# Altium project button.PrjPCB
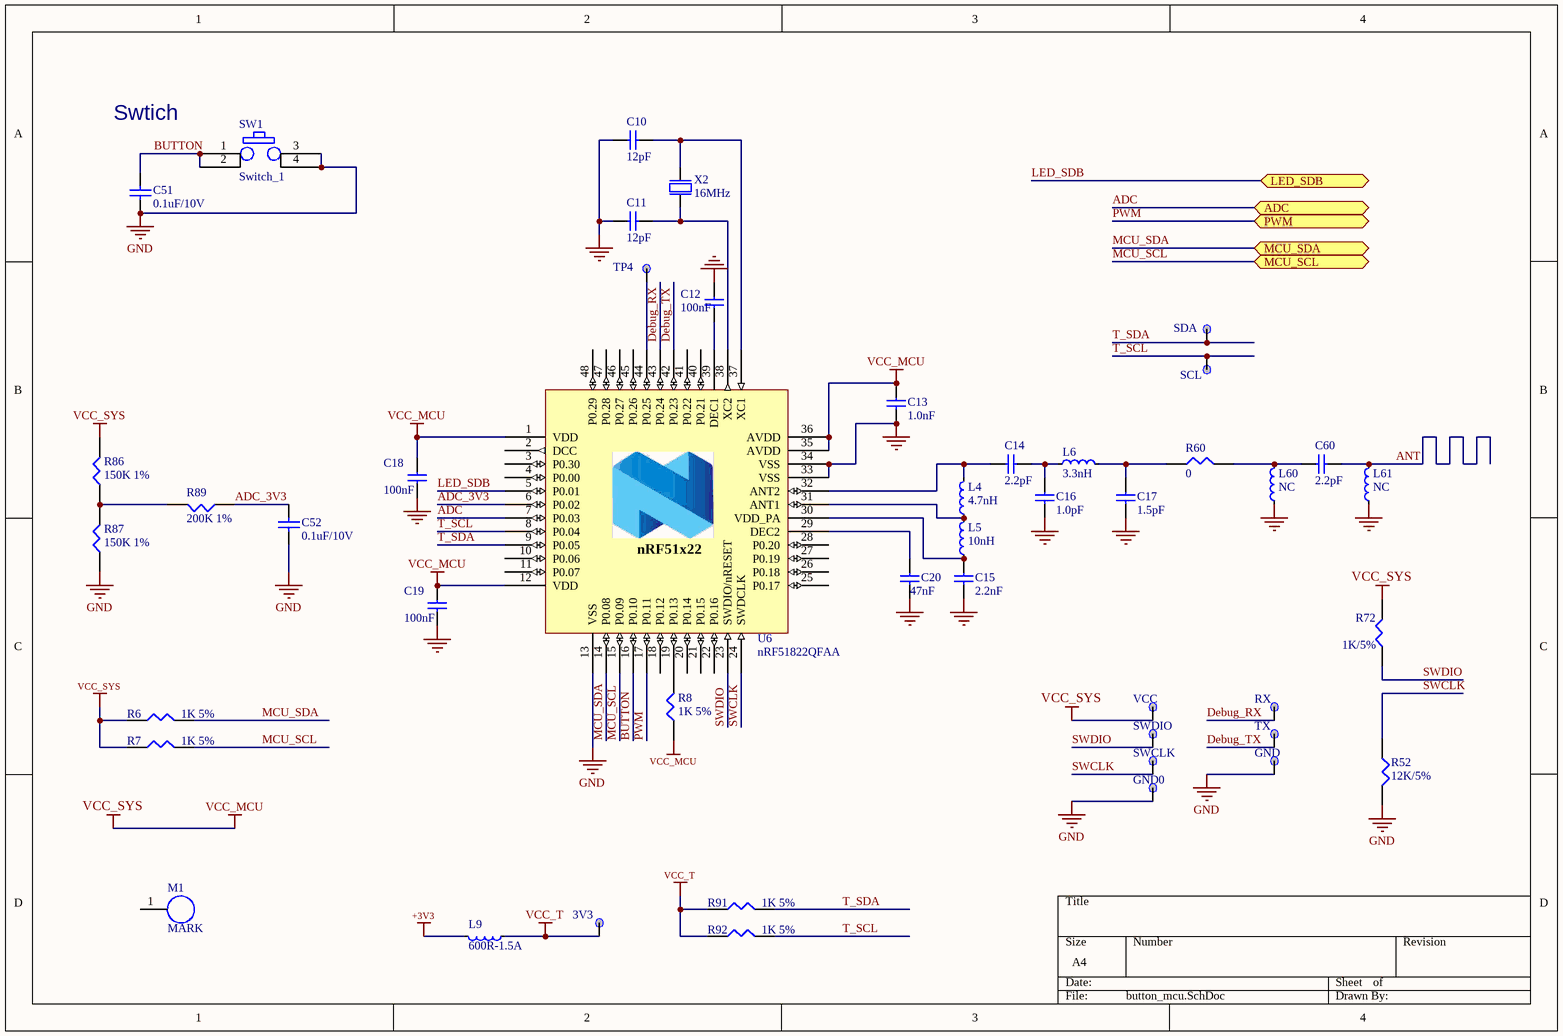
[diagram p0: button_mcu.SchDoc]
3 sheets, 85 parts. Net scope: flat (ports and power ports of the same name join across sheets).
Board file: button_PVT.PcbDoc
Sheets:
  button_mcu.SchDoc
  button_peripheral.SchDoc
  LED.SchDoc

## Sheet button_mcu.SchDoc
size A4

### Parts
3V3  TP  [TESTPOINT_PAD]  (value not drawn)
C10  12pF  [CAPC1005X04L]
C11  12pF  [CAPC1005X04L]
C12  100nF  [CAPC1005X04L]
C13  1.0nF  [CAPC1005X04L]
C14  2.2pF  [CAPC1005X04L]
C15  2.2nF  [CAPC1005X04L]
C16  1.0pF  [CAPC1005X04L]
C17  1.5pF  [CAPC1005X04L]
C18  100nF  [CAPC1005X04L]
C19  100nF  [CAPC1005X04L]
C20  47nF  [CAPC1005X04L]
C51  0.1uF/10V  [0402C]
C52  0.1uF/10V  [0402C]
C60  2.2pF  [0402C]
GND  TP  [TESTPOINT2]  (value not drawn)
GND0  TP  [TESTPOINT2]  (value not drawn)
L4  4.7nH  [INDC1005X04L]
L5  10nH  [INDC1005X04L]
L6  3.3nH  [INDC1005X04L]
L9  600R-1.5A  [L_0603]
L60  NC  [0402R]
L61  NC  [0402R]
M1  MARK  [Mark Point]
R6  1K 5%  [0402R]
R7  1K 5%  [0402R]
R8  1K 5%  [0402R]
R52  12K/5%  [0402R]
R60  0  [0402R]
R72  1K/5%  [0402R]
R86  150K 1%  [0402R]
R87  150K 1%  [0402R]
R89  200K 1%  [0402R]
R91  1K 5%  [0402R]
R92  1K 5%  [0402R]
RX  TP  [TESTPOINT2]  (value not drawn)
SCL  TP  [TESTPOINT_PAD]  (value not drawn)
SDA  TP  [TESTPOINT_PAD]  (value not drawn)
SW1  Switch_1  [KEY_Panasonic]
SWCLK  TP  [TESTPOINT2]  (value not drawn)
SWDIO  TP  [TESTPOINT2]  (value not drawn)
TP4  TP  [TESTPOINT2]  (value not drawn)
TX  TP  [TESTPOINT2]  (value not drawn)
U6  nRF51822QFAA  [QFN40P600X600X90-48N]
VCC  TP  [TESTPOINT2]  (value not drawn)
X2  16MHz  [XTAL/3225]

### Ports
ADC, LED_SDB, MCU_SCL, MCU_SDA, PWM

### Nets
+3V3: L9.2
GND: C10.2 C11.2 C12.1 C13.2 C15.2 C16.2 C17.2 C18.2 C19.2 C20.2 C51.1 C52.1 GND.1 GND0.1 L60.1 L61.1 R52.2 R87.1 SW1.3 SW1.4 U6.13(VSS) U6.33(VSS) U6.34(VSS) U6.49 X2.2(GND) X2.4(GND)
VCC_MCU: C13.1 C18.1 C19.1 R6.1 R7.1 R8.1 R72.2 R86.2 U6.1(VDD) U6.12(VDD) U6.35(AVDD) U6.36(AVDD) VCC.1  [also labelled VCC_SYS]
VCC_T: 3V3.1 L9.1 R91.1 R92.1
ADC: U6.7(P0.03) ; port ADC
ADC_3V3: C52.2 R89.1 U6.6(P0.02)
ANT: C60.2 L61.2
BUTTON: C51.2 SW1.1 SW1.2 U6.16(P0.10)
Debug_RX: RX.1 U6.43(P0.24)
Debug_TX: TX.1 U6.42(P0.23)
LED_SDB: U6.5(P0.01) ; port LED_SDB
MCU_SCL: R7.2 U6.15(P0.09) ; port MCU_SCL  [project net G_SCL]
MCU_SDA: R6.2 U6.14(P0.08) ; port MCU_SDA  [project net G_SDA]
PWM: U6.17(P0.11) ; port PWM
SWCLK: R52.1 SWCLK.1 U6.24(SWDCLK)
SWDIO: R72.1 SWDIO.1 U6.23(SWDIO/nRESET)
T_SCL: R92.2 SCL.1 U6.8(P0.04)
T_SDA: R91.2 SDA.1 U6.9(P0.05)
NetC10_1: C10.1 U6.37(XC1) X2.1(inp)
NetC11_1: C11.1 U6.38(XC2) X2.3(out)
NetC12_2: C12.2 U6.39(DEC1)
NetC14_1: C14.1 L4.2 U6.32(ANT2)
NetC14_2: C14.2 C16.1 L6.1
NetC15_1: C15.1 L5.1 U6.30(VDD_PA)
NetC17_1: C17.1 L6.2 R60.1
NetC20_1: C20.1 U6.29(DEC2)
NetC60_1: C60.1 L60.2 R60.2
NetL4_1: L4.1 L5.2 U6.31(ANT1)
NetR8_2: R8.2 U6.19(P0.13)
NetR86_1: R86.1 R87.2 R89.2
NetTP4_1: TP4.1 U6.44(P0.25)

Not connected (* = marked no-connect by the designer): M1 1; U6 2(DCC) 3(P0.30) 4(P0.00) 10(P0.06) 11(P0.07) 18(P0.12) 20(P0.14) 21(P0.15) 22(P0.16) 25(P0.17) 26(P0.18) 27(P0.19) 28(P0.20) 40(P0.21) 41(P0.22) 45(P0.26) 46(P0.27) 47(P0.28) 48(P0.29)

### Notes on the sheet
- Swtich
- (in symbol nRF51x22-QFAC) nRF51x22

### Library data of the parts
3V3 GND GND0 RX SCL SDA SWCLK SWDIO TP4 TX VCC = TP: Ordered by: Subcon
C10 C11 = C0402-12p: Capacitor, NP0, ±2%; Note: 50V; Artikkelnr Noca: 20029159; Artikkelnr Simpro: N.A.; Part Number: C0402-12p; Manufacturer: *; Manufacturer Part Number: *; Datasheet: *; LatestRevisionDate: 2011-05-11; Pin Count: 2; Publisher: Nordic Semiconductor; Published: 2009-05-08; Value: 12pF; Supplier: *; Supplier part number: *; 2nd source Supplier: *; 2nd source part number: *; Footprint Doc: 0402
C12 C18 C19 = C0402-100n: Capacitor, X7R, ±10%; Note: 16V; Artikkelnr Noca: 20039200; Artikkelnr Simpro: N.A.; Part Number: C0402-100n; Manufacturer: *; Manufacturer Part Number: *; Datasheet: *; LatestRevisionDate: 2009-11-23; Pin Count: 2; Publisher: Nordic Semiconductor; Published: 2009-05-08; Value: 100nF; Supplier: *; Supplier part number: *; 2nd source Supplier: *; 2nd source part number: *; Footprint Doc: 0402
C13 = C0402-1n0: Capacitor, X7R, ±10%; Note: 50V; Artikkelnr Noca: 20039223; Artikkelnr Simpro: N.A.; Part Number: C0402-1n0; Manufacturer: *; Manufacturer Part Number: *; Datasheet: *; LatestRevisionDate: 2009-11-23; Pin Count: 2; Publisher: Nordic Semiconductor; Published: 2009-05-08; Value: 1.0nF; Supplier: *; Supplier part number: *; 2nd source Supplier: *; 2nd source part number: *; Footprint Doc: 0402
C14 C60 = C0402-3.9p: Capacitor, NP0, ±0.1pF; Value: 3.9pF; Note: 50V; Artikkelnr Noca: N.A.; Part Number: C0402-3.9p; Manufacturer: *; Manufacturer Part Number: *; Datasheet: *; LatestRevisionDate: 2014-09-17; Pin Count: 2; Publisher: Nordic Semiconductor; Published: 2009-05-08; Supplier: *; Supplier part number: *; 2nd source Supplier: *; 2nd source part number: *; Footprint Doc: 0402; Artikkelnr Simpro: N.A.
C15 = C0402-2n2: Capacitor, X7R, ±10%; Note: 50V; Artikkelnr Noca: 20039221; Artikkelnr Simpro: N.A.; Part Number: C0402-2n2; Manufacturer: *; Manufacturer Part Number: *; Datasheet: *; LatestRevisionDate: 2009-11-23; Pin Count: 2; Publisher: Nordic Semiconductor; Published: 2009-05-08; Value: 2.2nF; Supplier: *; Supplier part number: *; 2nd source Supplier: *; 2nd source part number: *; Footprint Doc: 0402
C16 = C0402-1.0p: Capacitor, NP0, ±0.1pF; Note: 50V; Artikkelnr Noca: 20029140; Artikkelnr Simpro: N.A.; Part Number: C0402-1.0p; Manufacturer: *; Manufacturer Part Number: *; Datasheet: *; LatestRevisionDate: 2009-11-23; Pin Count: 2; Publisher: Nordic Semiconductor; Published: 2009-05-08; Value: 1.0pF; Supplier: *; Supplier part number: *; 2nd source Supplier: *; 2nd source part number: *; Footprint Doc: 0402
C17 = C0402-1.5p: Capacitor, NP0, ±0.1pF; Note: 50V; Artikkelnr Noca: 20029139; Artikkelnr Simpro: N.A.; Part Number: C0402-1.5p; Manufacturer: *; Manufacturer Part Number: *; Datasheet: *; LatestRevisionDate: 2009-11-23; Pin Count: 2; Publisher: Nordic Semiconductor; Published: 2009-05-08; Value: 1.5pF; Supplier: *; Supplier part number: *; 2nd source Supplier: *; 2nd source part number: *; Footprint Doc: 0402
C20 = C0402-47n: Capacitor, X7R, ±10%; Note: Chip Cap 10%; Artikkelnr Noca: 20039389; Artikkelnr Simpro: N.A.; Part Number: C0402-47n; Manufacturer: *; Manufacturer Part Number: *; Datasheet: *; LatestRevisionDate: 2009-05-08; Pin Count: 2; Publisher: Nordic Semiconductor; Published: 2009-05-08; Value: 47nF; Supplier: *; Supplier part number: *; 2nd source Supplier: *; 2nd source part number: *; Footprint Doc: 0402
C51 C52 = CAP: Capacitor; Value: 100pF; Ordered by: Subcon; Published: 8-Jun-2000; Revision: July-2002: Re-released for DXP Platform.; Publisher: Altium Limited
L4 = L0402-4n7: High frequency chip inductor ±5%; Manufacturer: Murata; Manufacturer Part Number: LQP15MN4N7B02D; Artikkelnr Noca: 33029164; Artikkelnr Simpro: N.A.; Part Number: L0402-4n7; Datasheet: http://search.murata.co.jp/Ceramy/image/img/PDF/ENG/L0075S0084LQP15M.pdf; LatestRevisionDate: 2012-09-19; Pin Count: 2; Publisher: Nordic Semiconductor; Published: 2009-05-08; Value: 4.7nH; Note: High frequency chip inductor ±5%; Supplier: Digi-Key; Supplier part number: 490-1132-1-ND; 2nd source Supplier: *; 2nd source part number: *; Footprint Doc: 0402
L5 L9 = L0402-27n: High frequency chip inductor ±5%; Manufacturer: Murata; Manufacturer Part Number: LQP15MN27NG02D; Value: 27nH; Note: High frequency chip inductor ±2%; Artikkelnr Noca: N.A.; Part Number: L0402-27n; Datasheet: http://search.murata.co.jp/Ceramy/image/img/PDF/ENG/L0075S0084LQP15M.pdf; LatestRevisionDate: 2014-09-17; Pin Count: 2; Publisher: Nordic Semiconductor; Published: 2014-06-12; Supplier: Digi-Key; Supplier part number: 490-6751-1-ND; 2nd source Supplier: *; 2nd source part number: *; Footprint Doc: 0402; Artikkelnr Simpro: N.A.
L6 = L0402-3n3: High frequency chip inductor ±5%; Manufacturer: Murata; Manufacturer Part Number: LQP15MN3N3B02D; Artikkelnr Noca: 33029369; Artikkelnr Simpro: N.A.; Part Number: L0402-3n3; Datasheet: http://search.murata.co.jp/Ceramy/image/img/PDF/ENG/L0075S0084LQP15M.pdf; LatestRevisionDate: 2012-09-19; Pin Count: 2; Publisher: Nordic Semiconductor; Published: 2009-05-08; Value: 3.3nH; Note: High frequency chip inductor ±5%; Supplier: Digi-Key; Supplier part number: 490-1130-1-ND; 2nd source Supplier: *; 2nd source part number: *; Footprint Doc: 0402
L60 L61 = L0402-4n7: High frequency chip inductor ±5%; Manufacturer: Murata; Manufacturer Part Number: LQP15MN4N7B02D; Value: 4.7nH; Artikkelnr Noca: 33029164; Artikkelnr Simpro: N.A.; Part Number: L0402-4n7; Datasheet: http://search.murata.co.jp/Ceramy/image/img/PDF/ENG/L0075S0084LQP15M.pdf; LatestRevisionDate: 2012-09-19; Pin Count: 2; Publisher: Nordic Semiconductor; Published: 2009-05-08; Note: High frequency chip inductor ±5%; Supplier: Digi-Key; Supplier part number: 490-1132-1-ND; 2nd source Supplier: *; 2nd source part number: *; Footprint Doc: 0402
M1 = PAD1: None
R6-R8 R52 R60 R72 R86 R87 R89 R91 R92 = RES1: 厂家：Yageo，型号：RC0402FR-0720RL
SW1 = Switch_1: 厂家：松下，型号：EVQPLMA15
U6 = nRF51x22-QFAC: Multi-protocol Bluetooth Low Energy, ANT and 2.4GHz proprietary system-on-chip; Manufacturer: Nordic Semiconductor; Note: nRF51422 - QFN48 6x6 0.4mm pitch; Artikkelnr Noca: N.A.; Part Number: nRF51x22-QFAC; Manufacturer Part Number: nRF51x22-QFAC; Datasheet: *; LatestRevisionDate: 2014-09-24; Pin Count: 48; Publisher: Nordic Semiconductor; Published: 2014-09-24; Value: nRF51x22-QFAC; Supplier: Nordic Semiconductor; Supplier part number: *; 2nd source Supplier: *; 2nd source part number: *; Footprint Doc: QFN-48; Artikkelnr Simpro: N.A.
X2 = NX2520SA-16MHZ-STD-CSW-5: XTAL SMD 2520, 16MHz, 8pF, ±40ppm; Manufacturer: NDK; Note: XTAL SMD 16.000MHz; Artikkelnr Noca: 22019192; Artikkelnr Simpro: N.A.; Part Number: NX2520SA-16MHZ-STD-CSW-5; Manufacturer Part Number: NX2520SA-16MHZ-STD-CSW-5; Datasheet: http://www.ndk.com/images/products/catalog/c_NX2520SA-STD-CSW-5_e.pdf; LatestRevisionDate: 2012-06-15; Pin Count: 4; Publisher: Nordic Semiconductor; Published: 2012-06-15; Value: 16MHz; Supplier: Digi-Key; Supplier part number: 644-1169-1-ND; 2nd source Supplier: *; 2nd source part number: *; Footprint Doc: BT-XTAL_2520

## Sheet button_peripheral.SchDoc
size A4
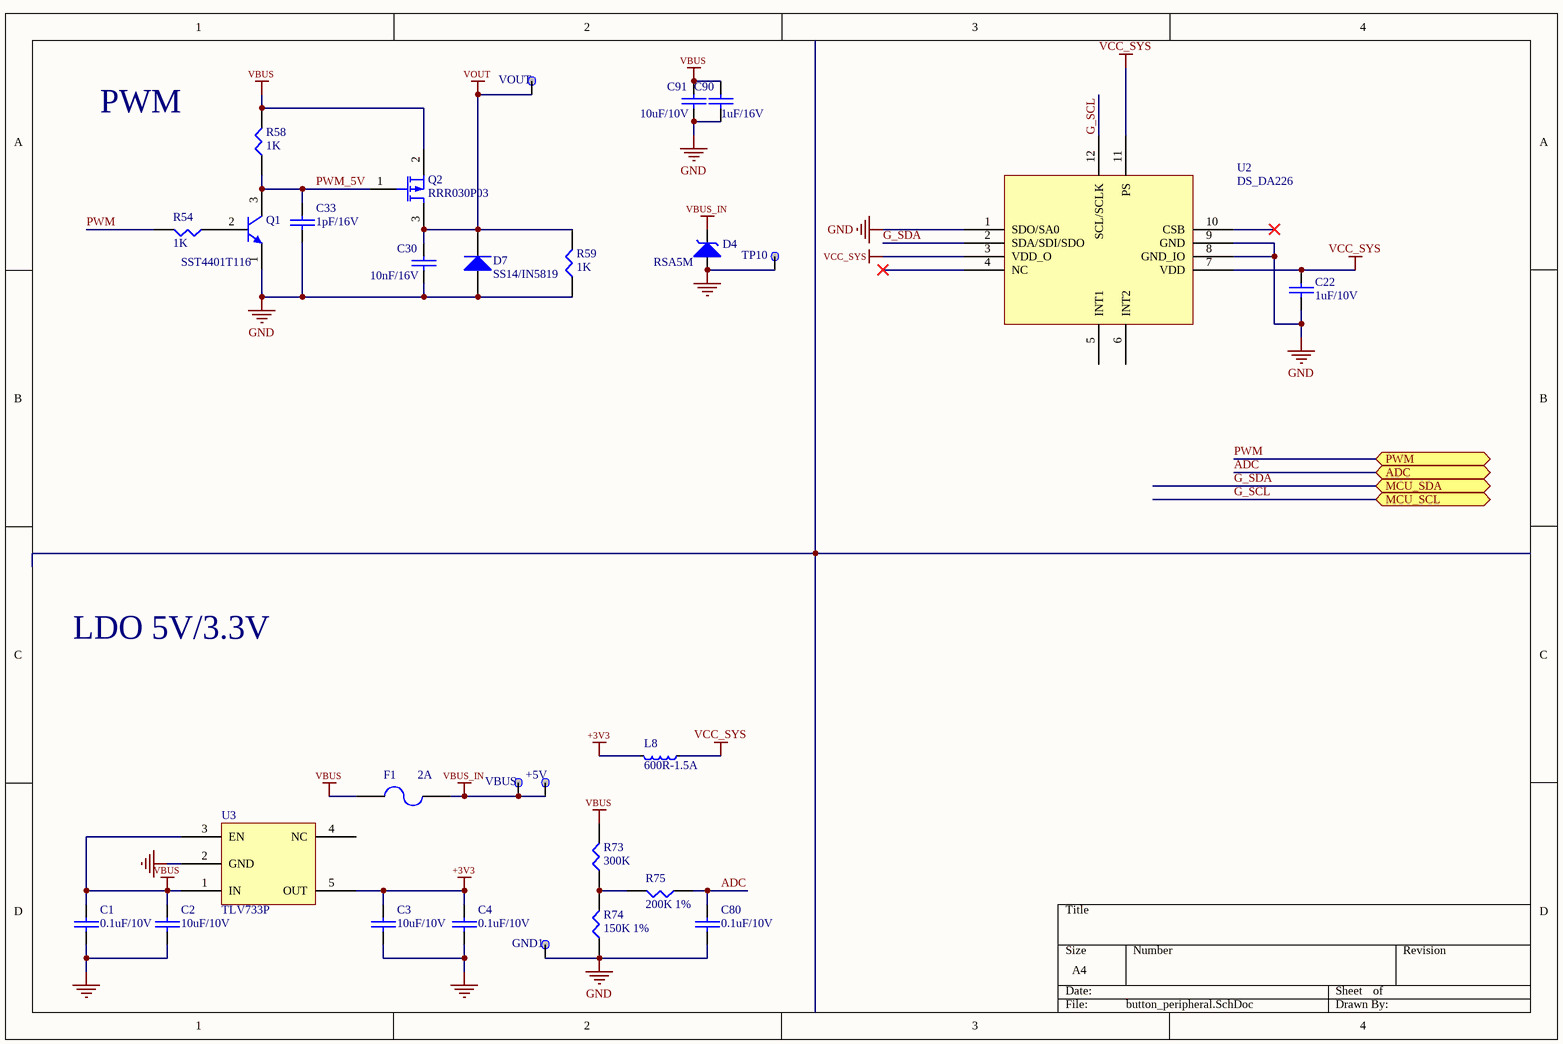
[diagram p1: button_peripheral.SchDoc]

### Parts
+5V  TP  [TESTPOINT2]  (value not drawn)
C1  0.1uF/10V  [0402C]
C2  10uF/10V  [0603C]
C3  10uF/10V  [0603C]
C4  0.1uF/10V  [0402C]
C22  1uF/10V  [0402C]
C30  10nF/16V  [0402C]
C33  1pF/16V  [0402C]
C80  0.1uF/10V  [0402C]
C90  1uF/16V  [0603C]
C91  10uF/10V  [LC-CASE-P_2012]
D4  RSA5M  [SOD-123]
D7  SS14/IN5819  [PROGRAM_1/2]
F1  2A  [0805]
GND1  TP  [TESTPOINT_PAD]  (value not drawn)
L8  600R-1.5A  [L_0603]
Q1  SST4401T116  [LC-SOT-23(SOT-23-3)]
Q2  RRR030P03  [TSMT3]
R54  1K  [0402R]
R58  1K  [0402R]
R59  1K  [0402R]
R73  300K  [0402R]
R74  150K 1%  [0402R]
R75  200K 1%  [0402R]
TP10  TP  [TESTPOINT_PAD]  (value not drawn)
U2  DS_DA226  [LGA-12]
U3  TLV733P  [SOT-23-5]
VBUS  TP  [TESTPOINT_PAD]  (value not drawn)
VOUT  TP  [TESTPOINT_PAD]  (value not drawn)

### Ports
ADC, MCU_SCL, MCU_SDA, PWM

### Nets
+3V3: C3.1 C4.1 L8.2 U3.5(OUT)
GND: C1.2 C2.2 C3.2 C4.2 C22.2 C30.2 C33.2 C80.2 C90.2 C91.2 D4.2(dIode2) D7.2(A) GND1.1 Q1.1(E) R59.1 R74.1 TP10.1 U2.1(SDO/SA0) U2.8(GND_IO) U2.9(GND) U3.2(GND)
VBUS: C1.1 C2.1 C90.1 C91.1 F1.1 Q2.2(S) R58.2 R73.2 U3.1(IN) U3.3(EN)
VBUS_IN: +5V.1 D4.1(Diode1) F1.2 VBUS.1
VCC_SYS: C22.1 L8.1 U2.3(VDD_O) U2.7(VDD) U2.11(PS)  [project net VCC_MCU]
VOUT: C30.1 D7.1(K) Q2.3(D) R59.2 VOUT.1
ADC: C80.1 R75.1 ; port ADC
G_SCL: U2.12(SCL/SCLK) ; port MCU_SCL
G_SDA: U2.2(SDA/SDI/SDO) ; port MCU_SDA
PWM: R54.2 ; port PWM
PWM_5V: C33.1 Q1.3(C) Q2.1(G) R58.1
NetQ1_2: Q1.2(B) R54.1
NetR73_1: R73.1 R74.2 R75.2

Not connected (* = marked no-connect by the designer): U2 4(NC)* 5(INT1) 6(INT2) 10(CSB)*; U3 4(NC)

### Notes on the sheet
- PWM
- LDO 5V/3.3V

### Library data of the parts
+5V GND1 TP10 VBUS VOUT = TP: Ordered by: Subcon
C1 C4 C22 C30 C33 C80 = CAP: 厂家：Murata，型号：GRM155R71A104KA01D
C2 C3 C90 C91 = CAP: 厂家：Murata，型号：GRM188R61A106KE69D
D4 = ESD_1: 厂家：ROHM，型号：VMNZC6.8CST2RA
D7 = Diode 1N4148: High Conductance Fast Diode
F1 = FUSE2: 厂家：万瑞和，型号：smd1206-200
L8 = L0402-27n: as L5 on sheet button_mcu; Part Number: L0402-27n; Datasheet: http://search.murata.co.jp/Ceramy/image/img/PDF/ENG/L0075S0084LQP15M.pdf; LatestRevisionDate: 2014-09-17; Pin Count: 2; Publisher: Nordic Semiconductor; Published: 2014-06-12; Supplier: Digi-Key; Supplier part number: 490-6751-1-ND; 2nd source Supplier: *; 2nd source part number: *; Footprint Doc: 0402; Artikkelnr Simpro: N.A.
Q1 = 2N3904: NPN General Purpose Amplifier; Published: 8-Jun-2000; LatestRevisionDate: 15-Jan-2003; LatestRevisionNote: PCB Footprint 'BCY-W3/D4.7' replaced; DatasheetVersion: 1997; PackageVersion: Sep-1998; PackageReference: TO-92A; Publisher: Altium Limited; PackageDescription: TO, Flat Index; 3 In-Line, Axial Leads; Body Dia. 4.5mm; Leads 0.51 x 0.48 mm (max); ComponentLink1Description: Manufacturer Link; ComponentLink1URL: http://www.fairchildsemi.com/; ComponentLink2Description: Datasheet; ComponentLink2URL: http://www.fairchildsemi.com/ds/2N%2F2N3904.pdf
Q2 = MOSFET-P: P-Channel MOSFET; Published: 8-Jun-2000; LatestRevisionDate: 17-Jul-2002; LatestRevisionNote: Re-released for DXP Platform.; PackageVersion: 1995/1996; PackageReference: E3; Publisher: Altium Limited; PackageDescription: TO, Flat Index; 3 In-Line, Axial Leads; Body Dia. 4.6mm; Lead Dia. 0.5 mm (max)
R54 R58 R59 R73-R75 = RES1: 厂家：Yageo，型号：RC0402FR-0720RL
U2 = LI: 厂家：ST，型号：LIS2DH12
U3 = AP3410

## Sheet LED.SchDoc
size A4
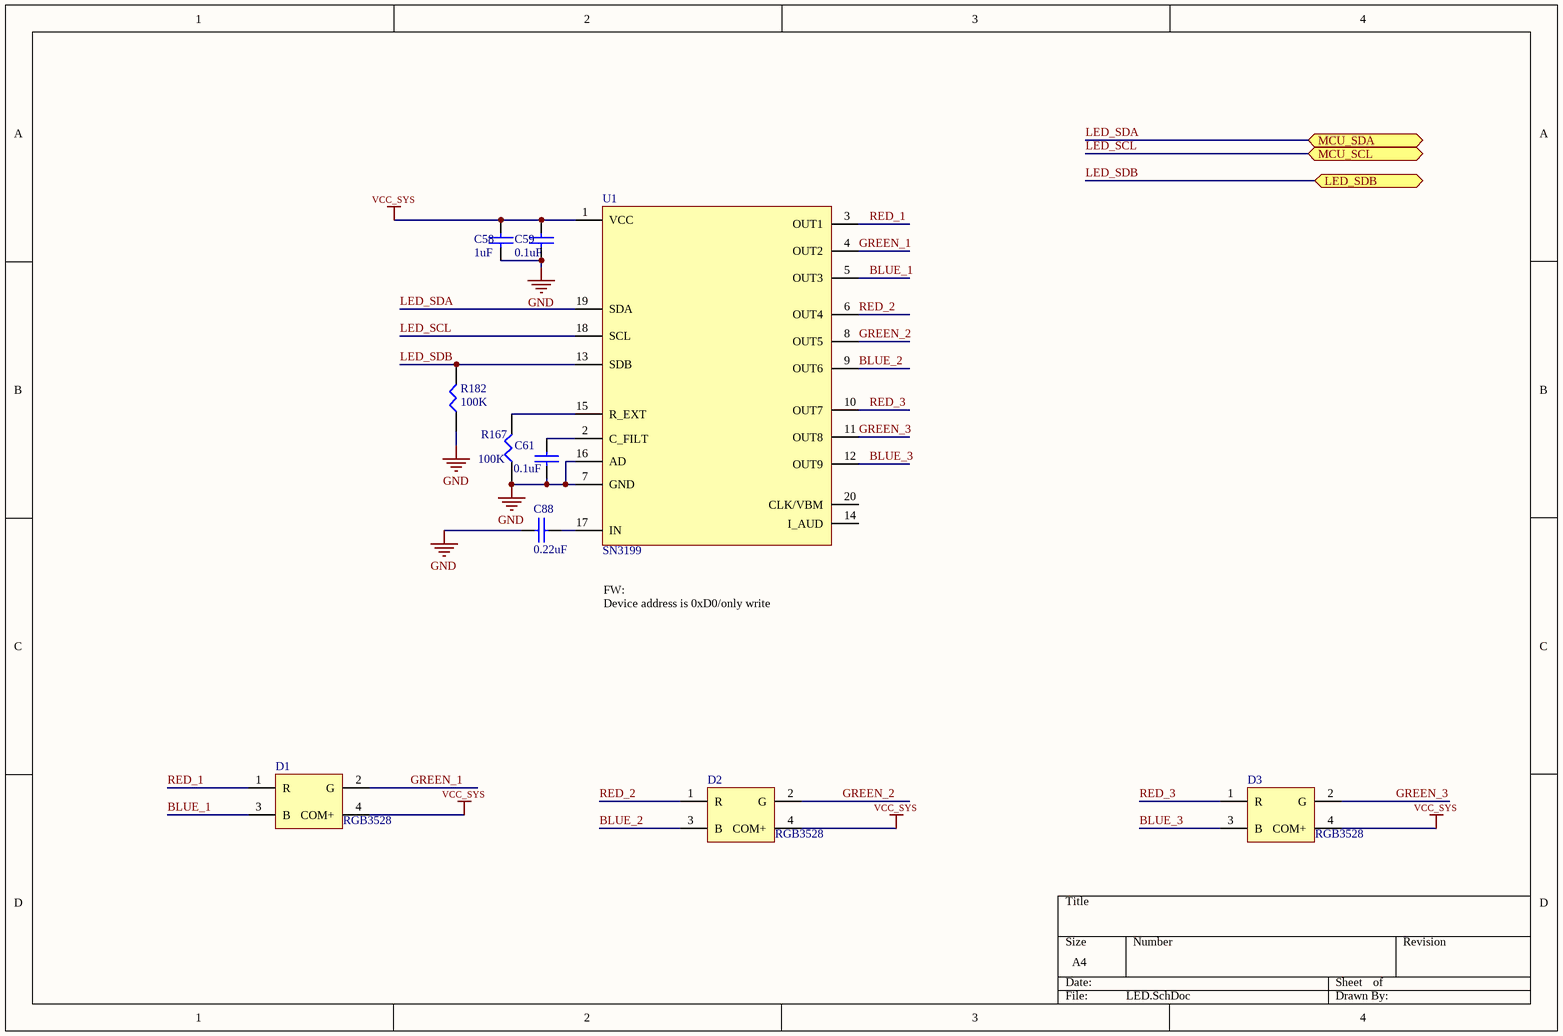
[diagram p2: LED.SchDoc]

### Parts
C58  1uF  [0402C]
C59  0.1uF  [0402C]
C61  0.1uF  [0402C]
C88  0.22uF  [0402C]
D1  RGB3528  [R6GHBHC]
D2  RGB3528  [R6GHBHC]
D3  RGB3528  [R6GHBHC]
R167  100K  [0402R]
R182  100K  [0402R]
U1  SN3199  [QFN20-B]

### Ports
LED_SDB, MCU_SCL, MCU_SDA

### Nets
GND: C58.2 C59.2 C61.2 C88.1 R167.1 R182.1 U1.7(GND) U1.16(AD)
VCC_SYS: C58.1 C59.1 D1.4(COM+) D2.4(COM+) D3.4(COM+) U1.1(VCC)  [project net VCC_MCU]
BLUE_1: D1.3(B) U1.5(OUT3)
BLUE_2: D2.3(B) U1.9(OUT6)
BLUE_3: D3.3(B) U1.12(OUT9)
GREEN_1: D1.2(G) U1.4(OUT2)
GREEN_2: D2.2(G) U1.8(OUT5)
GREEN_3: D3.2(G) U1.11(OUT8)
LED_SCL: U1.18(SCL) ; port MCU_SCL  [project net G_SCL]
LED_SDA: U1.19(SDA) ; port MCU_SDA  [project net G_SDA]
LED_SDB: R182.2 U1.13(SDB) ; port LED_SDB
RED_1: D1.1(R) U1.3(OUT1)
RED_2: D2.1(R) U1.6(OUT4)
RED_3: D3.1(R) U1.10(OUT7)
NetC61_1: C61.1 U1.2(C_FILT)
NetC88_2: C88.2 U1.17(IN)
NetR167_2: R167.2 U1.15(R_EXT)

Not connected (* = marked no-connect by the designer): U1 14(I_AUD) 20(CLK/VBM)

### Notes on the sheet
- FW:
  Device address is 0xD0/only write

### Library data of the parts
C58 = CAP: 1uF/10V/X7R/10%，0402
C59 C61 = CAP: 0.1uF/10V/X7R/10%，0402
C88 = CAP: 0.22uF/10V/X7R/10%，0402
R167 R182 = RES: 100K/5%，0402
U1 = SN3199: 厂家：SI-EN，型号：IS31FL3199-QFLS2-TR
D1-D3 = RGB3528: Published: 24-Mar-1999; LatestRevisionDate: 17-Jul-2002; LatestRevisionNote: Re-released for DXP Platform.; PackageReference: D-46_6A; Publisher: Altium Limited; PackageDescription: Bridge Rectifier; 4 Terminals; Body 16.8 x 16.8 mm (typ); Pitch 10.67 mm

## Nets that join several sheets
+3V3: button_mcu (L9.2), button_peripheral (C3.1 C4.1 L8.2 U3.5)
GND: button_mcu (26 pins), button_peripheral (21 pins), LED (8 pins)
VCC_MCU: button_mcu (13 pins), button_peripheral (5 pins), LED (6 pins)
ADC: button_mcu (U6.7), button_peripheral (C80.1 R75.1)
G_SCL: button_mcu (R7.2 U6.15), button_peripheral (U2.12), LED (U1.18)
G_SDA: button_mcu (R6.2 U6.14), button_peripheral (U2.2), LED (U1.19)
LED_SDB: button_mcu (U6.5), LED (R182.2 U1.13)
PWM: button_mcu (U6.17), button_peripheral (R54.2)